# Altium schematic sheet LED.SchDoc
size A4
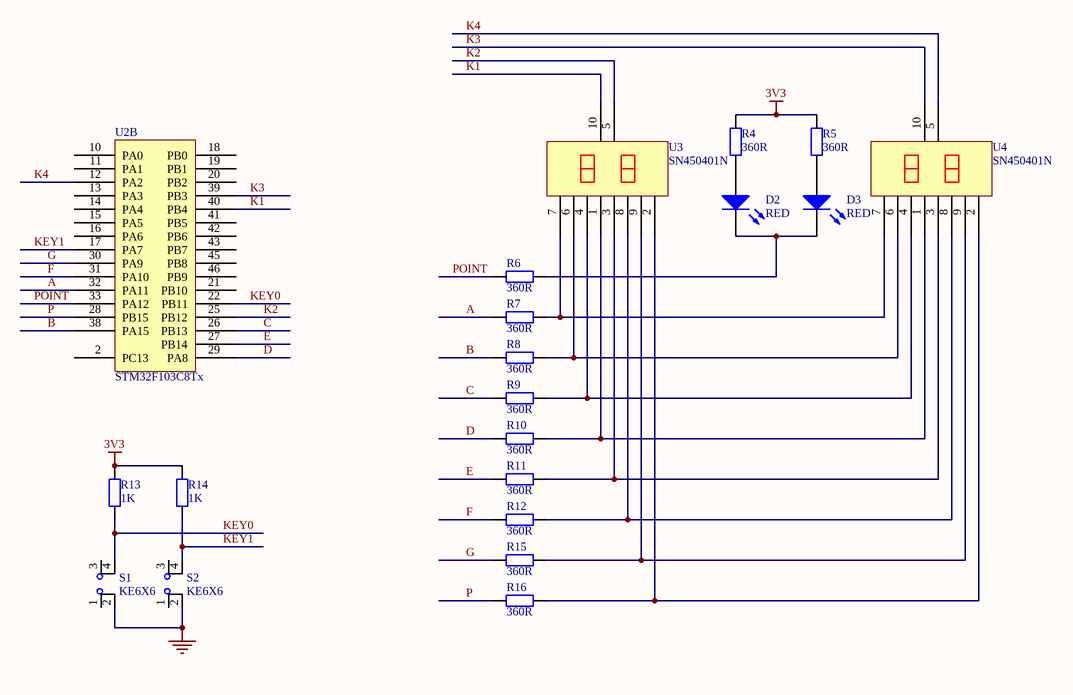
[diagram p0: LED.SchDoc]

## Parts
D2  RED  [LED3MM-RED]
D3  RED  [LED3MM-RED]
R4  value 360R  [R0603]
R5  value 360R  [R0603]
R6  value 360R  [R0603]
R7  value 360R  [R0603]
R8  value 360R  [R0603]
R9  value 360R  [R0603]
R10  value 360R  [R0603]
R11  value 360R  [R0603]
R12  value 360R  [R0603]
R13  value 1K  [R0603]
R14  value 1K  [R0603]
R15  value 360R  [R0603]
R16  value 360R  [R0603]
S1  KE6X6  [KE6X6-SMT]
S2  KE6X6  [KE6X6-SMT]
U2  STM32F103C8Tx  [PQFP48]  (part B of 2)
U3  SN450401N  [SMG 0.56-2P]
U4  SN450401N  [SMG 0.56-2P]

## Nets
3V3: R4.2 R5.2 R13.2 R14.2
GND: S1.2 S2.2
A: R7.1 U2.32(PA11)
B: R8.1 U2.38(PA15)
C: R9.1 U2.26(PB13)
D: R10.1 U2.29(PA8)
E: R11.1 U2.27(PB14)
F: R12.1 U2.31(PA10)
G: R15.1 U2.30(PA9)
K1: U2.40(PB4) U3.10
K2: U2.25(PB12) U3.5
K3: U2.39(PB3) U4.10
K4: U2.12(PA2) U4.5
KEY0: R13.1 S1.4 U2.22(PB11)
KEY1: R14.1 S2.4 U2.17(PA7)
P: R16.1 U2.28(PB15)
POINT: R6.1 U2.33(PA12)
NetD2_1: D2.1(A) R4.1
NetD2_2: D2.2(K) D3.2(K) R6.2
NetD3_1: D3.1(A) R5.1
NetR7_2: R7.2 U3.7 U4.7
NetR8_2: R8.2 U3.6 U4.6
NetR9_2: R9.2 U3.4 U4.4
NetR10_2: R10.2 U3.1 U4.1
NetR11_2: R11.2 U3.3 U4.3
NetR12_2: R12.2 U3.8 U4.8
NetR15_2: R15.2 U3.9 U4.9
NetR16_2: R16.2 U3.2 U4.2

Not connected (* = marked no-connect by the designer): S1 1 3; S2 1 3; U2 2(PC13) 10(PA0) 11(PA1) 13(PA3) 14(PA4) 15(PA5) 16(PA6) 18(PB0) 19(PB1) 20(PB2) 21(PB10) 41(PB5) 42(PB6) 43(PB7) 45(PB8) 46(PB9)

## Library data of the parts
D2 D3 = LED0: Typical INFRARED GaAs LED; Published: 8-Jun-2000; LatestRevisionDate: 08-Jul-2005; LatestRevisionNote: Mech Layer 1 removed.; PackageReference: LED-0; Publisher: Altium Limited; PackageDescription: LED; 2 Leads
R4-R16 = Res2: Resistor; Published: 8-Jun-2000; LatestRevisionDate: 17-Jul-2002; LatestRevisionNote: Re-released for DXP Platform.; PackageReference: AXIAL-0.4; Publisher: Altium Limited; PackageDescription: Axial Device, Thru-Hole; 2 Leads; 0.4 in Pin Spacing
S1 S2 = KE6X6-SMT